# EAGLE design can4vscp_rs485 (EAGLE 5.03)
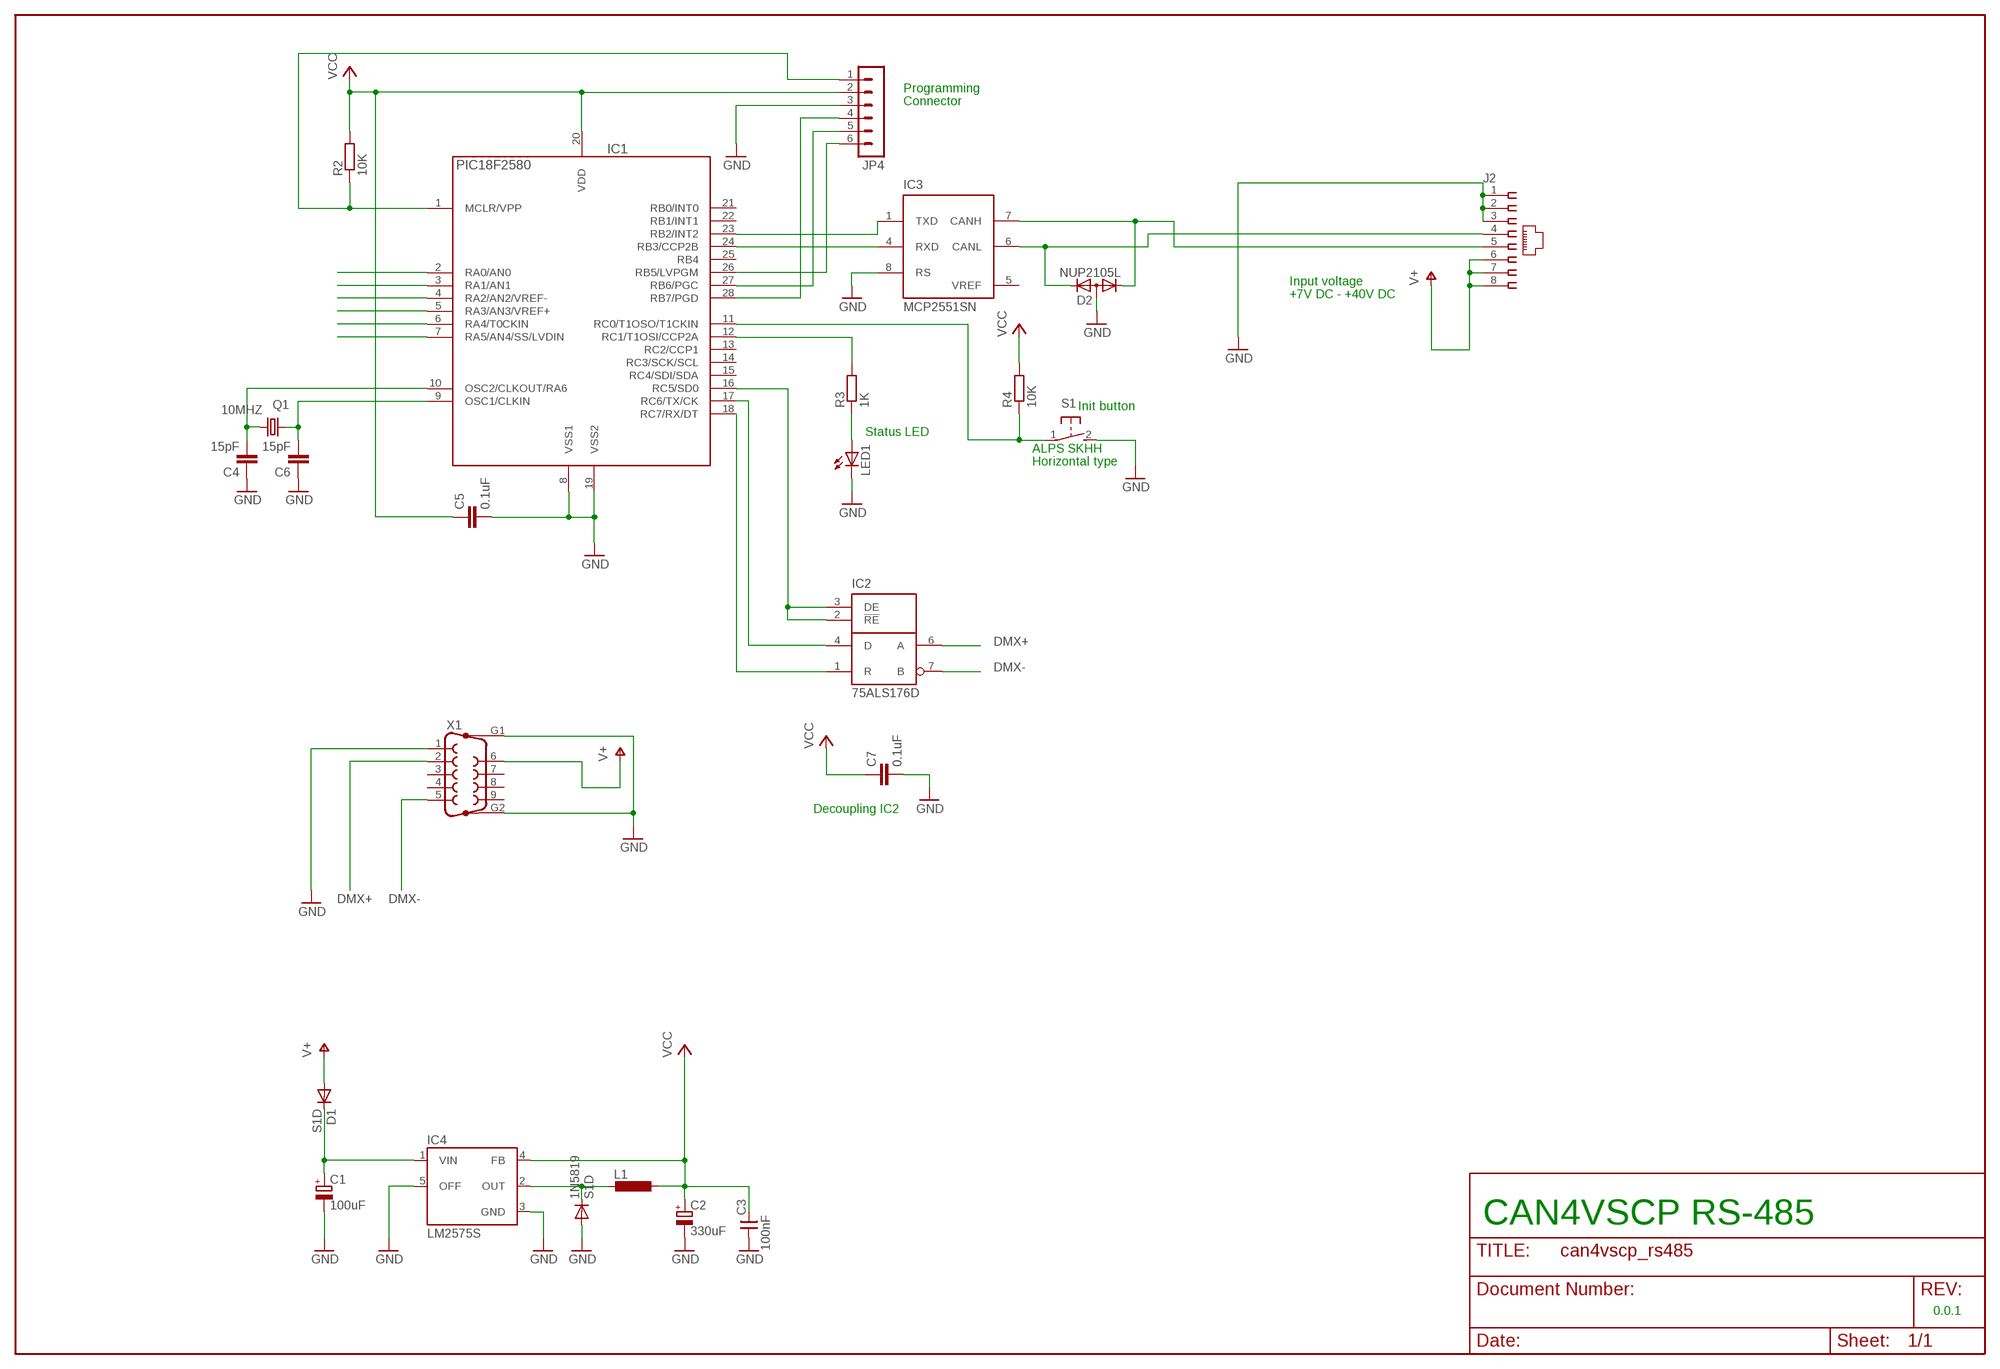
[diagram p0: schematic, sheet 1]

## Parts
1N5819  S1D  DIODE-SMB  [SMB]
C1  100uF  CPOL-EUD  [PANASONIC_D]
C2  330uF  CPOL-EUD  [PANASONIC_D]
C3  100nF  CNP-0805  [0805]
C4  15pF  C-EUC0805  [C0805]
C5  0.1uF  C-EUC0805  [C0805]
C6  15pF  C-EUC0805  [C0805]
C7  0.1uF  C-EUC0805  [C0805]
D1  S1D  DIODE-SMB  [SMB]
D2  NUP2105L  DIODE-2CA|ACSOT23  [SOT23]
IC1  PIC18F2580  PIC18LF252-I/SO  [SO28]
IC2  75ALS176D  [SO-08]
IC3  MCP2551SN  [SO-08]
IC4  LM2575S  [TO263-5]
J2  520426-4  [520426-4]
JP4  MA06-1  [MA06-1]
L1  DO3316P  [DO3316P]
LED1  LED3MM  [LED3MM]
Q1  10MHZ  CRYSTALHC49U-H  [HC49U-H]
R2  10K  R-EU_R0805  [R0805]
R3  1K  R-EU_R0805  [R0805]
R4  10K  R-EU_R0805  [R0805]
S1  31-XX  [B3F-31XX]
X1  F09HP  [F09HP]

## Nets
CANH: D2.1(K1) IC3.7(CANH) J2.5
CANL: D2.2(K2) IC3.6(CANL) J2.4
DMX+: IC2.6(A) X1.2
DMX-: IC2.7(B) X1.5
GND: 1N5819.A C1.- C2.- C3.1 C4.1 C5.2 C6.1 C7.2 D2.3(A) IC1.8(VSS1) IC1.19(VSS2) IC3.8(RS) IC4.3(GND) IC4.5(OFF) J2.1 J2.2 J2.3 JP4.3 LED1.K(C) S1.2(S) X1.1 X1.G1 X1.G2
I2: IC1.7(RA5/AN4/SS/LVDIN)
I3: IC1.6(RA4/T0CKIN)
I4: IC1.5(RA3/AN3/VREF+)
I5: IC1.4(RA2/AN2/VREF-)
I6: IC1.3(RA1/AN1)
I7: IC1.2(RA0/AN0)
N$1: 1N5819.C IC4.2(OUT) L1.1
N$2: C4.2 IC1.10(OSC2/CLKOUT/RA6) Q1.1
N$3: C1.+ D1.C IC4.1(VIN)
N$4: IC1.12(RC1/T1OSI/CCP2A) R3.2
N$5: LED1.A R3.1
N$6: IC1.11(RC0/T1OSO/T1CKIN) R4.1 S1.1(P)
N$7: C6.2 IC1.9(OSC1/CLKIN) Q1.2
N$8: IC1.18(RC7/RX/DT) IC2.1(R)
N$9: IC1.17(RC6/TX/CK) IC2.4(D)
N$10: IC1.16(RC5/SD0) IC2.2(!RE) IC2.3(DE)
N$12: IC1.1(MCLR/VPP) JP4.1 R2.1
N$13: IC1.28(RB7/PGD) JP4.4
N$14: IC1.27(RB6/PGC) JP4.5
N$15: IC1.26(RB5/LVPGM) JP4.6
RXCAN: IC1.24(RB3/CCP2B) IC3.4(RXD)
TXCAN: IC1.23(RB2/INT2) IC3.1(TXD)
V+: D1.A J2.6 J2.7 J2.8 X1.6
VCC: C2.+ C3.2 C5.1 C7.1 IC1.20(VDD) IC4.4(FB) JP4.2 L1.2 R2.2 R4.2
Unconnected: IC1.13(RC2/CCP1) IC1.14(RC3/SCK/SCL) IC1.15(RC4/SDI/SDA) IC1.21(RB0/INT0) IC1.22(RB1/INT1) IC1.25(RB4) X1.3 X1.4 X1.7 X1.8 X1.9

## Notes on the sheet
- Programming
- Connector
- Input voltage
- +7V DC - +40V DC
- Init button
- Status LED
- ALPS SKHH
- Horizontal type
- Decoupling IC2
- CAN4VSCP RS-485
- 0.0.1

## Power pins joined to a net without a drawn wire
GND: IC2.5(GND) IC3.2(VSS)
VCC: IC2.8(VCC) IC3.3(VDD)
VREF: IC3.5(VREF)

## Library data of the parts
1N5819 D1 = diode:DIODE-: DIODE
C1 C2 = rcl:CPOL-EU: POLARIZED CAPACITOR, European symbol
C3 = cap-master:CNP-: NON-POLARIZED CAP
C4-C7 = rcl:C-EU: CAPACITOR, European symbol
D2 = diode:DIODE-2CA|AC: Dual DIODE Cathode-Anode|Anode-Cathode
IC1 = pic_olin:PIC18*F252-?: 18F252, 28 pin, 32Kb prog, 1536 data, 256 EEPROM
IC2 = texas:75ALS176: DIFFERENTIAL BUS TRANSCEIVERS TIA/EIA-422-B, TIA/EIA-422-B + TIA/EIA-422-B TIA/EIA-422-B Operate at Data Rates up to 35 Mbaud Source: http://focus.ti.com/lit/ds/symlink/sn65als176.pdf
IC3 = microchip_can:MCP2551: High Speed CAN tranceiver
IC4 = v-reg-3:LM2575: National Semiconductor <http://www.national.com> 1.0A "Simple Switcher"(c) 52kHz, Vout 1.23-37V (HV: 57V), Vin 40V (HV: 60V), 50µA standby current
J2 = con-amp:520426-4: AMP connector
JP4 = con-lstb:MA06-1
L1 = inductor-coilcraft:DO3316P: COILCRAFT
LED1 = led:LED: LED OSRAM: - CHIPLED LG R971, LG N971, LY N971, LG Q971, LY Q971, LO R971, LY R971 LH N974, LH R974 LS Q976, LO Q976, LY Q976 LO Q996 - Hyper CHIPLED LW Q18S LB Q993, LB Q99A, LB R99A - SideLED LS A670, LO A670, LY A670, LG A670, LP A670 LB A673, LV A673, LT A673, LW A673 LH A674 LY A675 LS A676, LA A676, LO A676, LY A676, LW A676 LS A679, LY A679, LG A679 - Hyper Micro SIDELED® LS Y876, LA Y876, LO Y876, LY Y876 LT Y87S - SmartLED LW L88C, LW L88S LB L89C, LB L89S, LG L890 LS L89K, LO L89K, LY L89K LS L896, LA L896, LO L896, LY L896 - TOPLED LS T670, LO T670, LY T670, LG T670, LP T670 LSG T670, LSP T670, LSY T670, LOP T670, LYG T670 LG T671, LOG T671, LSG T671 LB T673, LV T673, LT T673, LW T673 LH T674 LS T676, LA T676, LO T676, LY T676, LB T676, LH T676, LSB T676, LW T676 LB T67C, LV T67C, LT T67C, LS T67K, LO T67K, LY T67K, LW E67C LS E67B, LA E67B, LO E67B, LY E67B, LB E67C, LV E67C, LT E67C LW T67C LS T679, LY T679, LG T679 LS T770, LO T770, LY T770, LG T770, LP T770 LB T773, LV T773, LT T773, LW T773 LH T774 LS E675, LA E675, LY E675, LS T675 LS T776, LA T776, LO T776, LY T776, LB T776 LHGB T686 LT T68C, LB T68C - Hyper Mini TOPLED® LB M676 - Mini TOPLED Santana® LG M470 LS M47K, LO M47K, LY M47K Source: http://www.osram.convergy.de/
Q1 = crystal:CRYSTAL: CRYSTAL
R2-R4 = rcl:R-EU_: RESISTOR, European symbol
S1 = switch-omron:31-XX: OMRON SWITCH
X1 = con-subd:F09HP: SUB-D

## Board
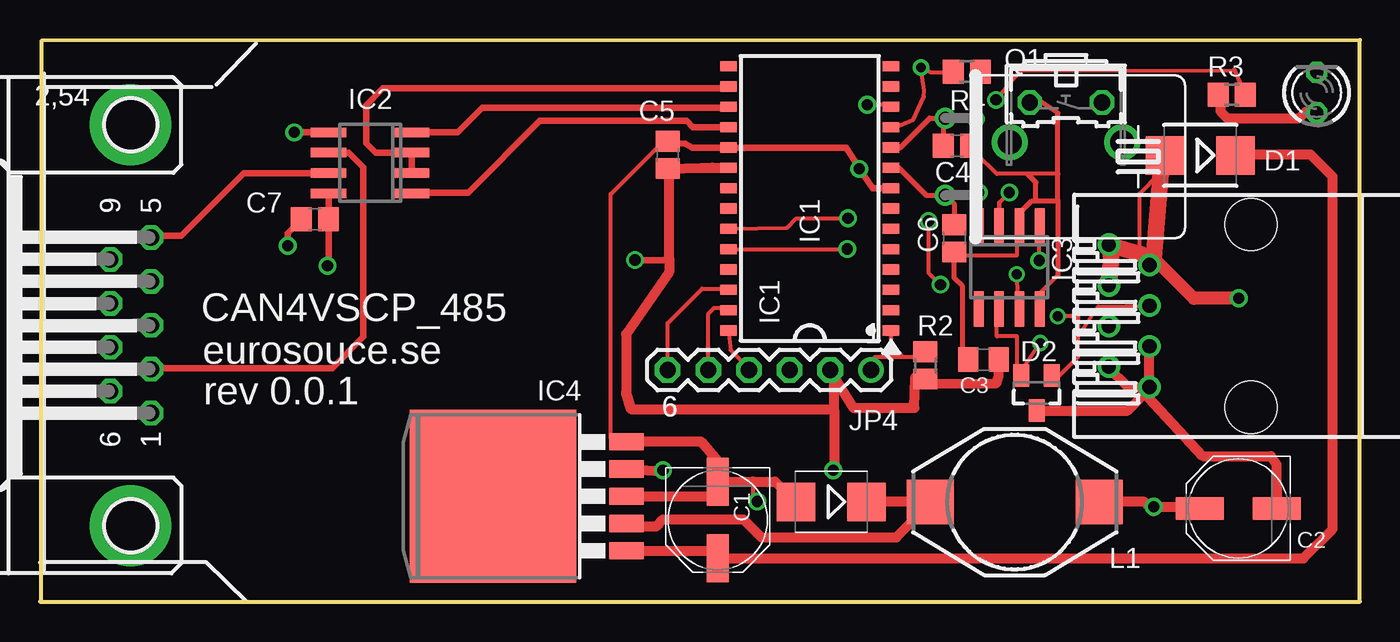
[diagram p1: board, top side]
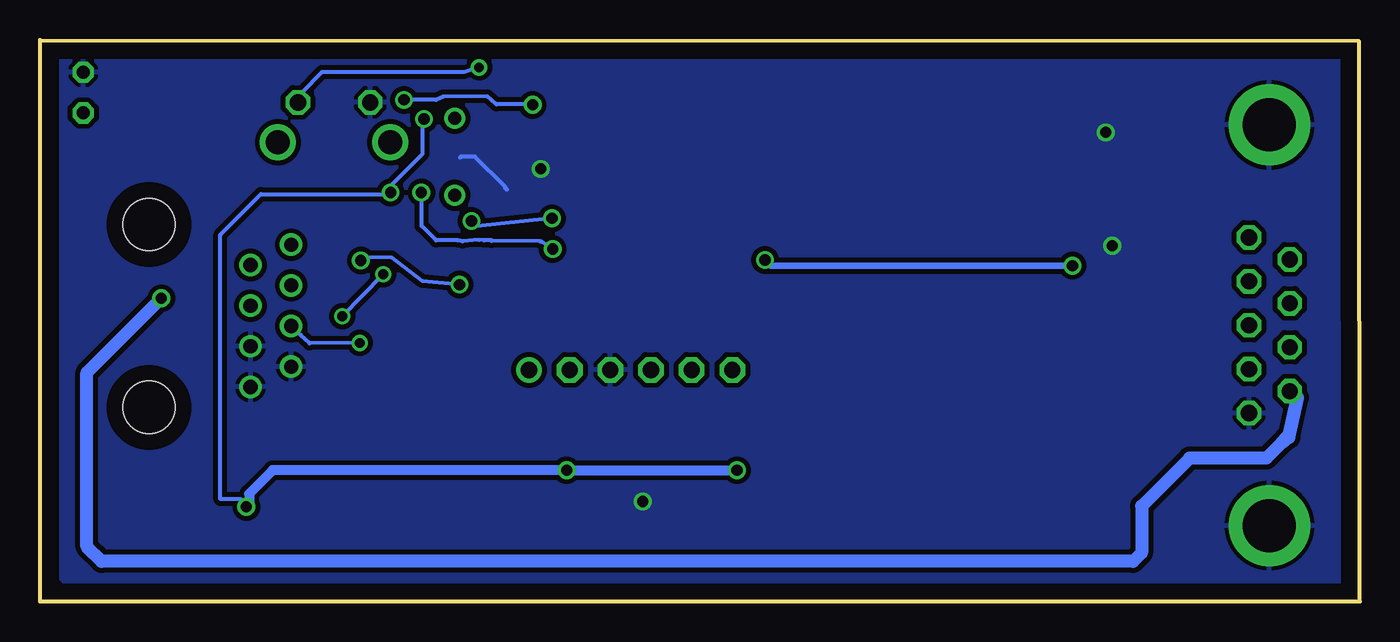
[diagram p2: board, bottom side, seen from below]

Size 82.46 x 35.08 mm. Coordinates in mm from the lower left corner, seen from the top.
Outline: 0,0 82.46,0 82.46,35.08 0.09,35.03 0.04,0.01
Copper layers (1*16): Top 0.035mm / dielectric 1.5mm / Bottom 0.035mm
Design rules "10mils": minimum track width 10mil, minimum drill 24mil, track to track 10mil, track to pad 10mil, pad to pad 10mil, via to via 10mil, smd to smd 10mil, copper to edge 40mil, drill to drill 10mil, minimum pad ring 10mil, minimum via ring 8mil, stop-mask expansion 0mil, vias tented up to drill 0mil, thermal gap 10mil

### Footprints (pad centres in the part's own frame; a part is rotated, then mirrored left to right if it is on the bottom)
SMB = smd 2.4 x 2.4: A 2.2,0; C -2.2,0
PANASONIC_D = smd 3 x 1.4: + 2.4,0; - -2.4,0
0805 = smd 1.27 x 1.524: 1 -0.953,0; 2 0.953,0
C0805 = smd 1.3 x 1.5: 1 -0.85,0; 2 0.85,0
SOT23 = smd 1 x 1.4: 1 -0.95,-1.1; 2 0.95,-1.1; 3 0,1.1
SO28 = smd 0.635 x 1.016: 1 -8.255,-5.08; 2 -6.985,-5.08; 3 -5.715,-5.08; 4 -4.445,-5.08; 5 -3.175,-5.08; 6 -1.905,-5.08; 7 -0.635,-5.08; 8 0.635,-5.08; 9 1.905,-5.08; 10 3.175,-5.08; 11 4.445,-5.08; 12 5.715,-5.08; 13 6.985,-5.08; 14 8.255,-5.08; 15 8.255,5.08; 16 6.985,5.08; 17 5.715,5.08; 18 4.445,5.08; 19 3.175,5.08; 20 1.905,5.08; 21 0.635,5.08; 22 -0.635,5.08; 23 -1.905,5.08; 24 -3.175,5.08; 25 -4.445,5.08; 26 -5.715,5.08; 27 -6.985,5.08; 28 -8.255,5.08
SO-08 = smd 0.6 x 2.2: 1 -1.905,-2.6; 2 -0.635,-2.6; 3 0.635,-2.6; 4 1.905,-2.6; 5 1.905,2.6; 6 0.635,2.6; 7 -0.635,2.6; 8 -1.905,2.6
TO263-5 = smd 1.067 x 2.159: 1 -3.404,-5.791; 2 -1.702,-5.791; 3 0,-5.791; 4 1.702,-5.791; 5 3.404,-5.791 | smd 10.8 x 10.41: 6 0,2.54
520426-4 = drill 0.889 round: 1 -4.445,6.35; 2 -3.175,8.89; 3 -1.905,6.35; 4 -0.635,8.89; 5 0.635,6.35; 6 1.905,8.89; 7 3.175,6.35; 8 4.445,8.89 | hole 3.251: -5.715,0; 5.715,0
MA06-1 = drill 1.016 pad 1.6 round: 1 -6.35,0 | drill 1.016 pad 1.6 octagon: 2 -3.81,0; 3 -1.27,0; 4 1.27,0; 5 3.81,0; 6 6.35,0
DO3316P = smd 2.92 x 2.79: 1 -5.28,0; 2 5.28,0
LED3MM = drill 0.813 octagon: A -1.27,0; K 1.27,0
HC49U-H = drill 0.813 round: 1 -2.413,-5.08; 2 2.413,-5.08
R0805 = smd 1.3 x 1.5: 1 -0.85,0; 2 0.85,0
B3F-31XX = drill 1.016 octagon: 1 -2.261,-1.245; 2 2.261,-1.245 | drill 1.499 pad 2.159 round: 3 -3.505,1.245; 4 3.505,1.245
F09HP = drill 1.016 octagon: 1 -5.486,-1.27; 2 -2.743,-1.27; 3 0,-1.27; 4 2.743,-1.27; 5 5.486,-1.27; 6 -4.115,1.27; 7 -1.372,1.27; 8 1.372,1.27; 9 4.115,1.27 | drill 3.302 pad 5.08 round: G1 -12.522,0; G2 12.522,0

### Placement (x,y rotation side)
1N5819  49.43,6.22 180 top
C1  42.34,5.09 270 top
C2  74.86,5.82 180 top
C3  58.94,15.11 0 top
C4  57.28,28.47 180 top
C5  39.22,27.9 90 top
C6  57.13,22.68 90 top
C7  17.17,23.88 180 top
D1  72.48,27.87 180 top
D2  62.26,13.03 180 top
IC1  48.09,25.19 90 top
IC2  20.63,27.41 90 top
IC3  60.55,20.88 180 top
IC4  30.84,6.58 90 top
J2  75.66,17.85 90 top
JP4  45.56,14.47 180 top
L1  60.89,6.22 0 top
LED1  79.76,31.79 90 top
Q1  61.62,27.79 270 top
R2  55.31,14.75 270 top
R3  74.45,31.66 0 top
R4  57.9,33.11 0 top
S1  64.09,29.94 180 top
X1  5.66,17.26 90 top

### Tracks (layer width: path | path; a pad name or v marks a point on that pad's centre or on a via)
CANH  (via drill 0.61)
  Top 0.254: 64.85,16.56 64.85,15.29 63.58,14.02 D2.1 | 64.85,16.56 66.11,18.42 69.41,18.47 J2.5 | v61.02,20.45 61.04,19.1 IC3.7 | v63.58,17.83 64.85,17.83 64.85,16.56
  Bottom 0.254: v63.58,17.83 v61.02,20.45
CANL  (via drill 0.61)
  Top 0.254: 61.04,14.02 61.04,16.56 59.77,16.56 59.77,17.83 IC3.6 | 61.04,14.02 v62.49,16.15 | D2.2 61.04,14.02
  Bottom 0.254: v62.49,16.15 65.61,16.13 66.16,16.64 J2.4
DMX+
  Top 0.406: IC2.6 19.28,28.04 20.2,27.13 20.2,16.54 18.24,14.58 6.99,14.58 X1.2
DMX-
  Top 0.406: IC2.7 12.73,26.77 8.82,22.86 7.04,22.86 X1.5
GND  (via drill 0.7)
  Top 0.254: 63.58,20.37 62.31,19.1 IC3.8 | IC1.19 43.06,28.35 | 51.36,26.8 v51.18,27.03 | C3.1 58.5,15.29 | 44.53,7.67 44.53,7.49 44.53,6.4 v44.81,6.25 | C6.1 57.23,21.64 61.04,21.64 61.04,22.91 IC3.2 | 63.58,26.72 59.77,26.72 58.5,27.99 C4.1 | C5.2 39.45,29.26 35.64,25.45 35.64,10.21 IC4.5
  Top 0.305: 63.58,25.06 63.58,20.37 | 63.58,25.06 63.58,26.72 63.58,30.53 62.4,31.31 S1.2 | 61.18,24.25 61.97,25.03 62.28,25.03 | 63.58,25.06 63.5,25.06 63.47,25.03 62.28,25.03 | C6.1 57.13,20.19 57.64,19.68 57.64,15.54 58.04,15.14 58.02,15.11 C3.1 | C4.1 58.13,28.41 | 61.67,26.72 62.21,26.19 62.21,25.09 62.23,25.09 62.28,25.03
  Top 0.406: IC3.2 61.18,24.25 | IC1.19 42.23,28.37 40.75,28.35 40.31,28.6 39.02,28.62 | IC1.8 52.03,25.82 v51.18,27.03 | 43.06,28.35 50.37,28.35 51.36,26.8 | v15.88,29.31 IC2.5 | v15.47,22.22 15.47,23.02 C7.2
  Top 0.61: C2.- 77.23,8.57 76.89,9.09 72.65,9.09 69.22,12.78 69.22,13.36 | 69.22,13.36 69.26,13.41 J2.1 | J2.3 | J2.1 J2.3 | J2.3 69.3,15.98 | 66.68,14.68 | 66.68,14.68 J2.2 | 69.22,13.36 68,13.36 66.68,14.68 | 69.42,13.41 69.45,13.44 | 69.42,13.41 J2.1 | D2.3 67.94,11.93 69.42,13.41 | IC4.3 41.68,6.58 42.42,6.53 42.52,7.52 42.55,7.49 | 42.55,7.49 42.6,7.44 | 42.55,7.49 C1.- | 47.23,6.19 47.32,6.09 | 47.23,6.19 1N5819.A 47.38,6.22 | C1.- 44.53,7.49 45.92,7.49 47.23,6.19 | 47.38,6.22 47.48,6.12 | 47.38,6.22 46.83,6.77 | IC4.5 41.33,9.98 42.37,8.76 42.37,7.49 42.34,7.46 | 42.34,7.46 42.24,7.37 | C1.- 42.34,7.46
  Bottom 0.254: 53.3,25.73 53.4,25.83 53.4,25.91 55.29,27.8 56.15,27.8 56.22,27.73
  pour Bottom (isolate 0.305): 0.67,34.09 0.67,1.45 1.26,0.86 80.55,0.86 81.52,1.83 81.52,34.32 81.59,34.39 1.04,34.39 0.82,34.17
N$1
  Top 0.61: L1.1 1N5819.C | L1.1 55.68,6.22 55.73,6.17 | L1.1 55.61,6.12 53.5,4.01 45.06,4.01 43.95,5.13 38.92,5.13 38.48,4.7 36.55,4.7 | IC4.2 36.55,4.7 | 36.55,4.7 36.43,4.83
N$2
  Top 0.305: IC1.10 53.74,28.37 55.58,30.2 Q1.1 | Q1.1 56.72,30.2 56.77,30.15 | Q1.1 56.54,30.17 56.57,30.15 56.43,30.01 C4.2
N$3
  Top 0.61: 42.57,2.69 42.57,2.61 | 42.57,2.69 C1.+ 78.92,2.69 80.75,4.52 80.75,26.54 79.38,27.91 74.45,27.91 | IC4.1 42.55,3.17 42.57,2.69 | 74.45,27.91 74.5,27.87 D1.C | 74.45,27.91 74.32,28.04
N$4  (via drill 0.7)
  Top 0.254: R3.2 74.59,33.23 74.65,33.19 61.23,33.16 v59.73,31.34 | 53.38,31.03 53.39,31.01 | IC1.12 53.38,31.03 | v51.68,31.03 53.37,31.03 53.38,31.03
  Bottom 0.254: v59.73,31.34 57.71,31.34 57.28,31.54 54.52,31.56 53.95,31.06 51.42,31.06 v51.68,31.03
N$5
  Top 0.254: R3.1 73.74,31.8
  Top 0.61: 73.74,31.8 73.74,30.63 74.17,30.2 78.67,30.2 79.05,30.58 79.07,30.56 LED1.A
N$6  (via drill 0.61)
  Top 0.254: R4.1 57.23,33.07 55.66,33.06 v55.03,33.37 55.23,31.9 55.21,31.55 54.54,30.09 53.73,29.75 IC1.11
  Bottom 0.254: v55.03,33.37 55.96,33.07 64.85,33.07 66.12,31.8 S1.1
N$7
  Top 0.305: IC1.9 53.66,27.1 55.38,25.37 56.47,25.37 56.54,25.45 | 56.54,25.45 56.57,25.48 | 56.54,25.45 56.54,25.4 | 56.54,25.4 Q1.2 | C6.2 57.13,24.82 56.54,25.4
N$8
  Top 0.406: IC1.18 40.78,29.64 40.39,30.02 31.22,30.02 26.75,25.55 23.28,25.55 IC2.1
N$9
  Top 0.406: IC2.4 26.09,29.31 27.64,30.86 42.96,30.86 IC1.17
N$10
  Top 0.406: IC2.2 IC2.3 20.96,28.04 20.38,28.62 20.38,31.01 21.42,32.05 42.89,32.05 IC1.16
N$12
  Top 0.254: 53.87,15.29 52.15,15.29 52.15,14.02 JP4.1 | 53.87,15.29 54.69,15.29 R2.1 | 53.87,15.29 53.87,15.31 53.17,16.01 IC1.1
N$13
  Top 0.254: 44.38,14.47 44.42,14.43 | 44.38,14.47 JP4.4 | IC1.28 43.14,15.71 44.38,14.47
N$14
  Top 0.254: JP4.5 41.75,17.98 42.11,18.34 43.22,18.34 43.2,18.32 IC1.27
N$15
  Top 0.254: JP4.6 39.21,17.4 41.36,19.55 43.07,19.55 43.12,19.6 IC1.26
RXCAN  (via drill 0.7)
  Top 0.254: IC1.24 48.39,22 v50.43,22.02 | IC3.4 58.62,23.47 | IC3.4 | v58.64,25.56 IC3.4
  Bottom 0.254: v50.43,22.02 51.12,22.47 51.22,22.5 54.27,22.54 54.23,22.56 54.71,22.57 55.04,22.6 56.06,22.5 56.36,22.56 57.71,22.56 58.62,23.47 58.62,25.37 v58.64,25.56
TXCAN  (via drill 0.7)
  Top 0.254: IC1.23 46.68,23.36 47.25,23.94 48.53,23.94 v50.47,23.94 | v55.5,23.77 55.5,20.55 v56.25,19.8 | IC3.1 62.45,23.45 62.43,23.42 v62.42,21.31
  Bottom 0.254: v50.47,23.94 55.47,23.4 v55.5,23.77 | v56.25,19.8 58.58,20.01 60.5,21.49 62.14,21.51 v62.42,21.31
V+  (via drill 0.7)
  Top 0.254: D1.A 69.93,26.72 68.66,25.45 68.66,21.64 68.69,21.73
  Top 0.813: v74.88,18.95 72.08,18.95 69.58,21.45
  Top 1.016: 66.91,21.54 66.91,21.65 | 66.91,21.54 J2.8 68.69,21.73 69.37,21.54 69.37,21.19 J2.7 | J2.6 66.91,21.54 | D1.A 70.12,27.87 69.58,21.45 69.55,21.09
  Bottom 0.254: 4.5,10.34 4.45,10.24
  Bottom 0.813: 4.88,9.93 5.85,8.96 10.65,8.96 13.64,5.97 13.64,3.05 14.18,2.51 78.62,2.51 79.53,3.43 79.53,14.3 v74.88,18.95 | 4.88,9.93 4.53,10.24 | 4.45,10.24 3.89,12.75 X1.6 | 4.88,9.93 4.5,10.34
VCC  (via drill 0.7)
  Top 0.254: 58.5,33.07 R4.2 58.58,32.94 v58.48,30.15 | 54.69,14.02 R2.2 | 49.61,14.02 JP4.2 | v60.56,25.55 59.91,24.91 IC3.3 59.91,24.94 59.92,24.94
  Top 0.406: IC1.20 43.04,27.07 | IC1.20 | IC1.20 | C7.1 IC2.8 18.03,21.05 v17.96,20.98 | v37.16,21.34 39.19,21.34 39.29,21.44
  Top 0.61: IC1.20 42.02,27.11 41.33,27.09 C5.1 39.3,27.04 39.29,23.96 39.29,21.44 39.29,20.58 36.62,16.71 36.62,13.07 36.6,13.06 36.91,12.02 | 54.69,14.02 54.62,12.1 50.81,12.1 49.61,14.02 49.61,12.02 36.91,12.02 | C3.2 59.89,14.09 59.74,13.64 55.12,13.61 | 55.12,13.61 55.08,13.9 R2.2 | 55.12,13.61 54.99,13.82 | IC4.4 38.81,8.1 v38.92,8.2 | C2.+ 72.47,5.84 72.39,5.92 v69.57,5.92 69.57,5.64 68.99,6.22 L1.2 | 36.91,12.02 49.55,12.02 49.61,11.96 49.61,8.25 v49.56,8.2
  Bottom 0.254: v58.48,30.15 58.55,30 58.55,27.99 60.56,25.98 v60.56,25.55 61.04,25.45 68.66,25.45 71.2,22.91 71.2,6.4 69.93,6.4 v69.57,5.92
  Bottom 0.406: v17.96,20.98 36.81,20.98 v37.16,21.34
  Bottom 0.61: v38.92,8.2 v49.56,8.2 67.92,8.2 69.4,6.73 69.4,6.09 v69.57,5.92

### Text on the board
tNames: 2,54 | 9 | 5 | CAN4VSCP_485 | 1 | 1 | eurosouce.se | 6 | 6 | rev 0.0.1 | 6 | 1